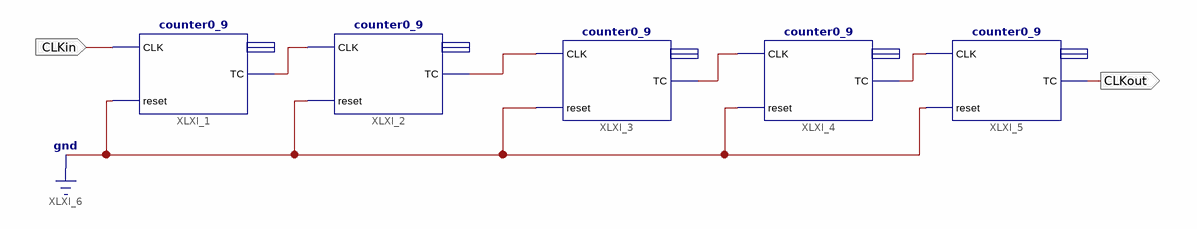
[diagram p0: schematic sheet 1]
// Xilinx ISE schematic div10k.sch (spartan6) as structural Verilog: 5 symbols, 2 ports
module div10k (
  input  CLKin,
  output CLKout
);

  wire XLXN_2, XLXN_3, XLXN_4, XLXN_5;

  counter0_9 XLXI_1 (.reset(1'b0), .CLK(CLKin), .TC(XLXN_2));  // open: C
  counter0_9 XLXI_2 (.reset(1'b0), .CLK(XLXN_2), .TC(XLXN_3));  // open: C
  counter0_9 XLXI_3 (.reset(1'b0), .CLK(XLXN_3), .TC(XLXN_4));  // open: C
  counter0_9 XLXI_4 (.reset(1'b0), .CLK(XLXN_4), .TC(XLXN_5));  // open: C
  counter0_9 XLXI_5 (.reset(1'b0), .CLK(XLXN_5), .TC(CLKout));  // open: C
endmodule
